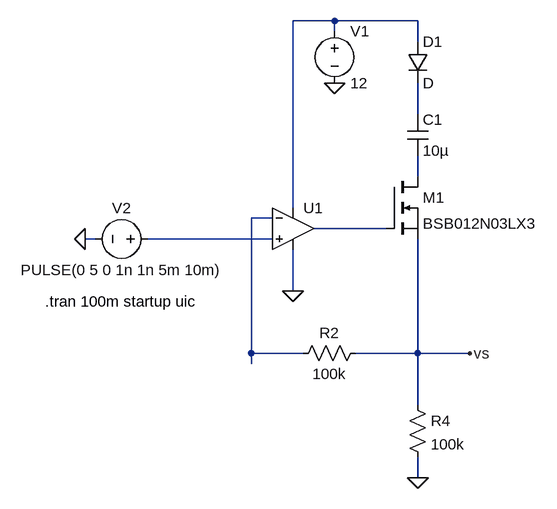
[diagram p0: schematic ProgrammedCapacitorCharge.asc]
ProgrammedCapacitorCharge.asc, the LTspice schematic file:
Version 4
SHEET 1 880 680
WIRE 304 -128 240 -128
WIRE 432 -128 304 -128
WIRE 304 -112 304 -128
WIRE 432 -96 432 -128
WIRE 432 16 432 -32
WIRE 432 112 432 80
WIRE 240 160 240 -128
WIRE 208 176 176 176
WIRE 384 192 272 192
WIRE -64 208 -80 208
WIRE 208 208 16 208
WIRE 240 288 240 224
WIRE 176 384 176 176
WIRE 256 384 176 384
WIRE 432 384 432 208
WIRE 432 384 336 384
WIRE 512 384 432 384
WIRE 176 400 176 384
WIRE 432 464 432 384
WIRE 432 576 432 544
FLAG 240 288 0
FLAG 304 -32 0
FLAG -80 208 0
FLAG 512 384 vs
FLAG 432 576 0
DATAFLAG 496 384 ""
DATAFLAG 352 192 "$-V(vs)"
SYMBOL voltage 304 -128 R0
SYMATTR InstName V1
SYMATTR Value 12
SYMBOL voltage 32 208 R90
WINDOW 0 -32 56 VBottom 2
WINDOW 3 32 56 VTop 2
WINDOW 123 0 0 Left 0
WINDOW 39 0 0 Left 0
SYMATTR InstName V2
SYMATTR Value PULSE(0 5 0 1n 1n 5m 10m)
SYMBOL nmos 384 112 R0
SYMATTR InstName M1
SYMATTR Value BSB012N03LX3
SYMBOL res 352 368 R90
WINDOW 0 0 56 VBottom 2
WINDOW 3 32 56 VTop 2
SYMATTR InstName R2
SYMATTR Value 100k
SYMBOL res 416 448 R0
SYMATTR InstName R4
SYMATTR Value 100k
SYMBOL cap 416 16 R0
SYMATTR InstName C1
SYMATTR Value 10µ
SYMBOL diode 416 -96 R0
SYMATTR InstName D1
SYMBOL OpAmps\\UniversalOpAmp2 240 192 R0
SYMATTR InstName U1
TEXT -142 304 Left 2 !.tran 100m startup uic

The netlist it stands for:
* ProgrammedCapacitorCharge.asc
V1 N001 0 12
V2 N006 0 PULSE(0 5 0 1n 1n 5m 10m)
M1 N003 N005 vs vs BSB012N03LX3
R2 vs N004 100k
R4 vs 0 100k
C1 N002 N003 10µ
D1 N001 N002 D
XU1 N006 N004 N001 0 N005 level2 Avol=1Meg GBW=10Meg Slew=10Meg Ilimit=25m Rail=0 Vos=0 En=0 Enk=0 In=0 Ink=0 Rin=500Meg  ; pins In+ In- V+ V- OUT
.model D D
.lib standard.dio
.model NMOS NMOS
.model PMOS PMOS
.lib standard.mos
.tran 100m startup uic
.lib UniversalOpAmp2.lib
.backanno
.end